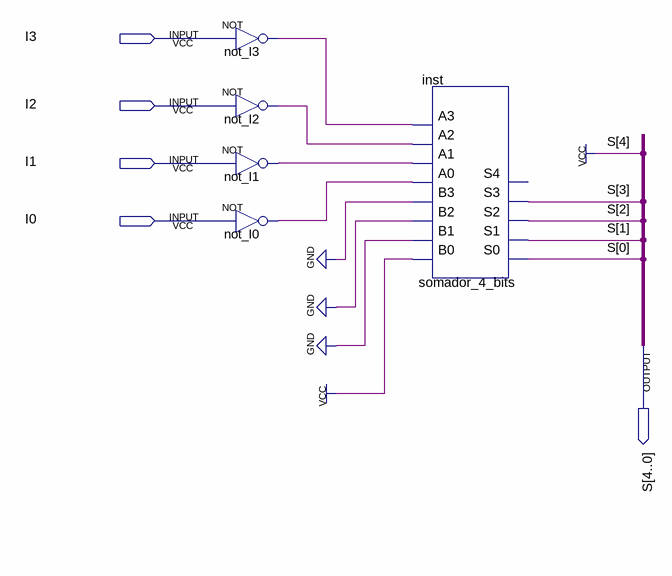
[diagram p0: schematic sheet]
// Quartus schematic complemento_2.bdf as structural Verilog: 5 symbols, 5 pins
module complemento_2 (
  input  I3,
  input  I2,
  input  I1,
  input  I0,
  output [4:0] S
);

  wire not_I0_out, not_I1_out, not_I2_out, not_I3_out;

  not not_I3 (not_I3_out, I3);
  not not_I2 (not_I2_out, I2);
  not not_I1 (not_I1_out, I1);
  not not_I0 (not_I0_out, I0);
  somador_4_bits inst (
    .B0(1'b1), .B1(1'b0), .B2(1'b0), .B3(1'b0), .A0(not_I0_out), .A1(not_I1_out), .A2(not_I2_out),
    .A3(not_I3_out), .S0(S[0]), .S1(S[1]), .S2(S[2]), .S3(S[3]));  // open: S4

  assign S[4] = 1'b1;
endmodule
